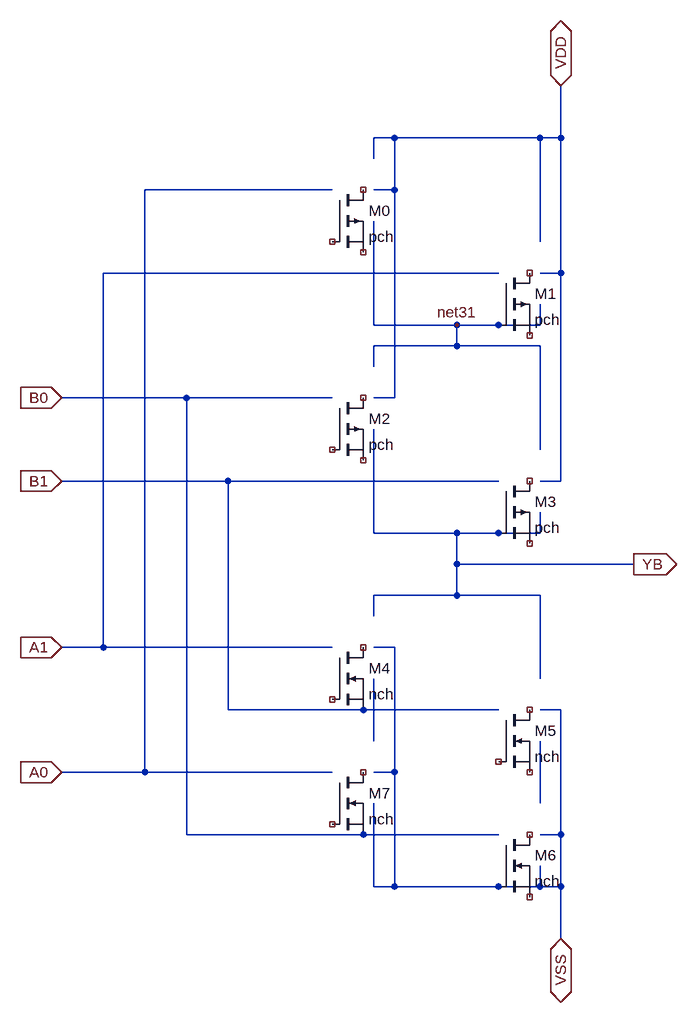
[diagram p0: schematic nr222.asc]
nr222.asc, the LTspice schematic file:
Version 4
SHEET 1 1056 1520
WIRE 704 848 976 848
WIRE 704 848 704 800
WIRE 704 896 704 848
WIRE 704 800 832 800
WIRE 704 896 832 896
WIRE 832 800 832 768
WIRE 576 800 704 800
WIRE 576 800 576 640
WIRE 832 1024 832 896
WIRE 576 896 704 896
WIRE 576 928 576 896
WIRE 832 1216 832 1120
WIRE 288 1264 768 1264
WIRE 288 1264 288 592
WIRE 288 592 512 592
WIRE 96 592 288 592
WIRE 576 1120 576 1024
WIRE 224 272 512 272
WIRE 224 1168 224 272
WIRE 224 1168 512 1168
WIRE 96 1168 224 1168
WIRE 160 400 768 400
WIRE 160 976 160 400
WIRE 160 976 512 976
WIRE 96 976 160 976
WIRE 864 112 864 192
WIRE 832 400 864 400
WIRE 864 400 864 192
WIRE 832 192 864 192
WIRE 864 720 864 400
WIRE 832 720 864 720
WIRE 576 272 608 272
WIRE 608 272 608 192
WIRE 608 192 832 192
WIRE 576 592 608 592
WIRE 832 352 832 192
WIRE 576 192 608 192
WIRE 576 224 576 192
WIRE 608 592 608 272
WIRE 704 512 704 480
WIRE 704 480 832 480
WIRE 704 512 832 512
WIRE 576 480 576 320
WIRE 576 480 704 480
WIRE 832 480 832 448
WIRE 832 672 832 512
WIRE 576 512 704 512
WIRE 576 544 576 512
WIRE 864 1424 864 1344
WIRE 832 1264 864 1264
WIRE 864 1264 864 1072
WIRE 832 1072 864 1072
WIRE 864 1344 864 1264
WIRE 832 1344 864 1344
WIRE 608 1344 608 1168
WIRE 608 1344 832 1344
WIRE 576 1168 608 1168
WIRE 608 1168 608 976
WIRE 576 976 608 976
WIRE 832 1344 832 1312
WIRE 576 1344 608 1344
WIRE 576 1344 576 1216
WIRE 352 1072 768 1072
WIRE 352 1072 352 720
WIRE 352 720 768 720
WIRE 96 720 352 720
FLAG 704 480 net31
SYMBOL NMOS 512 1168 R0
SYMATTR InstName M7
SYMATTR Value nch
SYMATTR Value2 w=2u l=1u
SYMBOL NMOS 768 1264 R0
SYMATTR InstName M6
SYMATTR Value nch
SYMATTR Value2 w=2u l=1u
SYMBOL NMOS 768 1072 R0
SYMATTR InstName M5
SYMATTR Value nch
SYMATTR Value2 w=2u l=1u
SYMBOL NMOS 512 976 R0
SYMATTR InstName M4
SYMATTR Value nch
SYMATTR Value2 w=2u l=1u
SYMBOL PMOS 768 720 R0
SYMATTR InstName M3
SYMATTR Value pch
SYMATTR Value2 w=6u l=1u
SYMBOL PMOS 512 592 R0
SYMATTR InstName M2
SYMATTR Value pch
SYMATTR Value2 w=6u l=1u
SYMBOL PMOS 768 400 R0
SYMATTR InstName M1
SYMATTR Value pch
SYMATTR Value2 w=6u l=1u
SYMBOL PMOS 512 272 R0
SYMATTR InstName M0
SYMATTR Value pch
SYMATTR Value2 w=6u l=1u
FLAG 976 848 YB
IOPIN 976 848 Out
FLAG 864 1424 VSS
IOPIN 864 1424 BiDir
FLAG 864 112 VDD
IOPIN 864 112 BiDir
FLAG 96 720 B1
IOPIN 96 720 In
FLAG 96 592 B0
IOPIN 96 592 In
FLAG 96 976 A1
IOPIN 96 976 In
FLAG 96 1168 A0
IOPIN 96 1168 In

The netlist it stands for:
* nr222.asc
* M7: nch w=2u l=1u (symbol NMOS not certain, pin order unknown); nets seen at it: B0
* M6: nch w=2u l=1u (symbol NMOS not certain, pin order unknown); nets seen at it: VSS
* M5: nch w=2u l=1u (symbol NMOS not certain, pin order unknown); nets seen at it: 
* M4: nch w=2u l=1u (symbol NMOS not certain, pin order unknown); nets seen at it: B1
* M3: pch w=6u l=1u (symbol PMOS not certain, pin order unknown); nets seen at it: YB
* M2: pch w=6u l=1u (symbol PMOS not certain, pin order unknown); nets seen at it: 
* M1: pch w=6u l=1u (symbol PMOS not certain, pin order unknown); nets seen at it: net31
* M0: pch w=6u l=1u (symbol PMOS not certain, pin order unknown); nets seen at it: 
.backanno
.end